# Altium schematic sheet Flyback Controller.SchDoc
size A; SheetNumber: 5; SheetTotal: 9
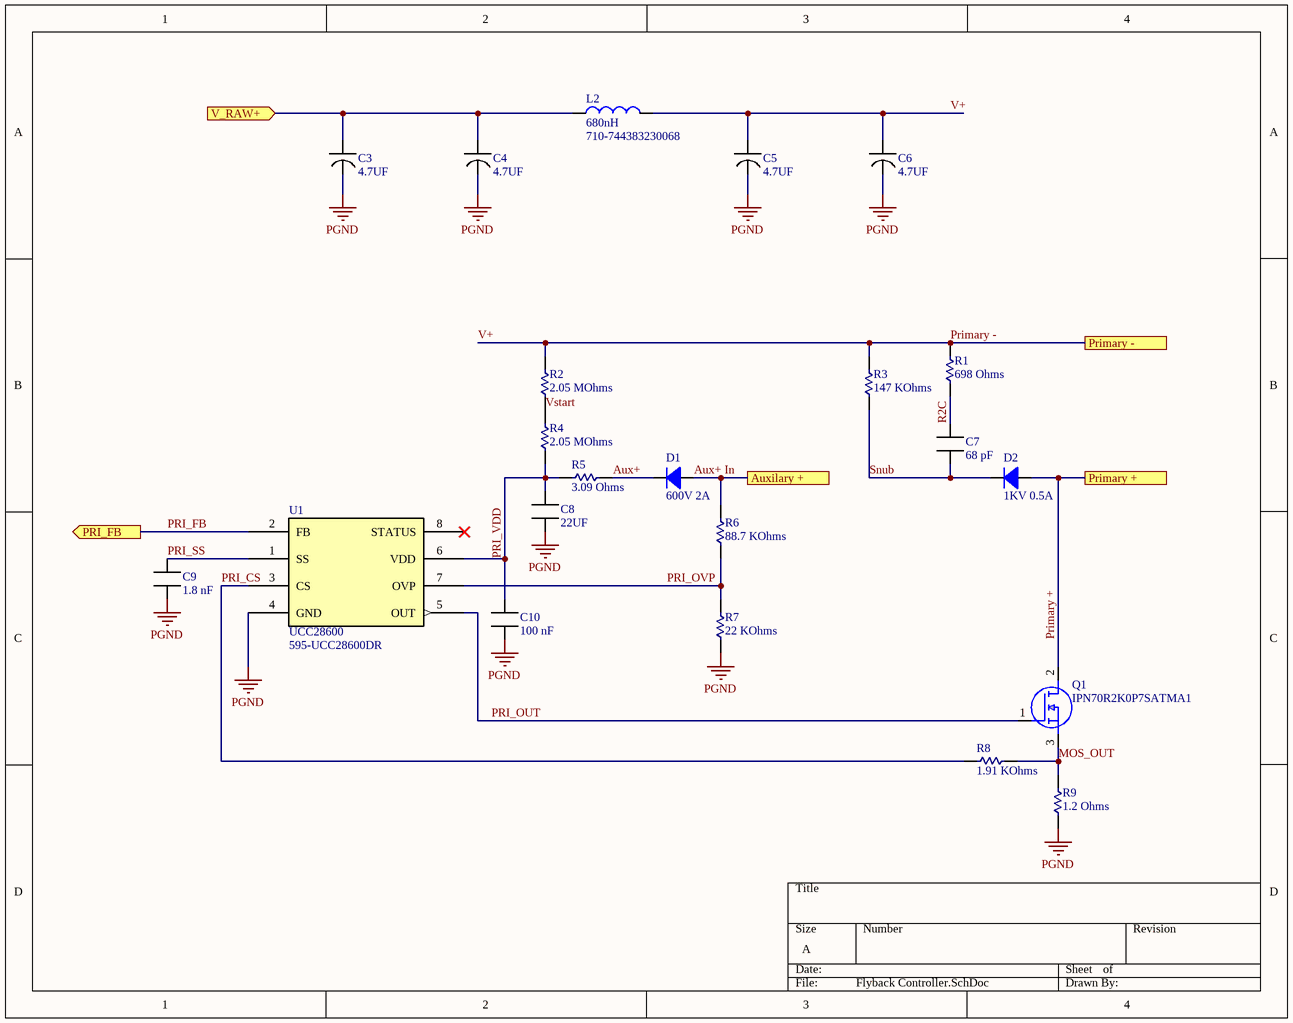
[diagram p0: Flyback Controller.SchDoc]

## Parts
C3  4.7UF  [Alum Radial Cap 5mm]
C4  4.7UF  [Alum Radial Cap 5mm]
C5  4.7UF  [Alum Radial Cap 5mm]
C6  4.7UF  [Alum Radial Cap 5mm]
C7  68 pF  [Cap 1206]
C8  22UF  [Res 0805]
C9  1.8 nF  [Cap 0603]
C10  100 nF  [Cap 1206]
D1  600V 2A  [FLAT_SMT]
D2  1KV 0.5A  [FLAT_SMT]
L2  680nH  Supplier Part Number 1: 710-744383230068  [IND 1008]
Q1  IPN70R2K0P7SATMA1  [SOT-223-3]
R1  698 Ohms  [Res 0805]
R2  2.05 MOhms  [RES 1206]
R3  147 KOhms  [Res 0805]
R4  2.05 MOhms  [RES 1206]
R5  3.09 Ohms  [Res 0805]
R6  88.7 KOhms  [Res 0805]
R7  22 KOhms  [Res 0805]
R8  1.91 KOhms  [Res 0805]
R9  1.2 Ohms  [RES 1206]
U1  UCC28600  Supplier Part Number 1: 595-UCC28600DR  [UCC28600]

## Ports
Auxilary +, PRI_FB (out), Primary +, Primary -, V_RAW+ (in)

## Nets
PGND: C3.2 C4.2 C5.2 C6.2 C8.1 C9.1 C10.1 R7.1(A) R9.1(A) U1.4(GND)
Aux+: D1.2 R5.2(B)
Aux+ In: D1.1 R6.2(B) ; port Auxilary +
MOS_OUT: Q1.3(S) R8.2(B) R9.2(B)
PRI_CS: R8.1(A) U1.3(CS)
PRI_FB: U1.2(FB) ; port PRI_FB
PRI_OUT: Q1.1(G) U1.5(OUT)
PRI_OVP: R6.1(A) R7.2(B) U1.7(OVP)
PRI_SS: C9.2 U1.1(SS)
PRI_VDD: C8.2 C10.2 R4.1(A) R5.1(A) U1.6(VDD)
Primary +: D2.1 Q1.2(D) ; port Primary +
Primary -: C5.1 C6.1 L2.2 R1.2(B) R2.2(B) R3.2(B) ; port Primary -  [also labelled V+]
R2C: C7.2 R1.1(A)
Snub: C7.1 D2.2 R3.1(A)
V_RAW+: C3.1 C4.1 L2.1 ; port V_RAW+
Vstart: R2.1(A) R4.2(B)

Not connected (* = marked no-connect by the designer): U1 8(STATUS)*

## Library data of the parts
C3-C6 = ESE475M400AH9AA: Aluminum Electrolytic Capacitors - Radial Leaded 400V 4.7uF 20% 1000Hrs; Supplier 1: Mouser; Supplier Part Number 1: 80-ESE475M400AH9AA
C7 = CC1206JKNPOCBN680: Multilayer Ceramic Capacitors MLCC - SMD/SMT 1k V 68 pF C0G 1206 5%; Supplier 1: Mouser; Supplier Part Number 1: 603-CC126JKNPOCBN680
C8 = CL21A226MAYNNNE: Multilayer Ceramic Capacitors MLCC - SMD/SMT 22uF+/-20% 25V X5R 2 0805; Supplier 1: Mouser; Supplier Part Number 1: 187-CL21A226MAYNNNE
C9 = VJ0603Y182KXACW1BC: Multilayer Ceramic Capacitors MLCC - SMD/SMT 0603 1800pF 50volts X7R 10%; Supplier 1: Mouser; Supplier Part Number 1: 77-VJ0603Y182KXACBC
C10 = CGA5L4X7T2W104M160AA: Multilayer Ceramic Capacitors MLCC - SMD/SMT CGA 1206 450V 0.1uF X7T 20% AEC-Q200; Supplier 1: Mouser; Supplier Part Number 1: 810-CGA5L4X7T2W104MA
D1 = CMF01(TE12L,Q,M): Diodes - General Purpose, Power, Switching 600V 2A M-FLAT; Supplier 1: Mouser; Supplier Part Number 1: 757-CMF01TE12LQM
D2 = CMF05(TE12L,Q,M): Rectifiers Super Fast Diode 1000V 0.5A 100ns; Supplier 1: Mouser; Supplier Part Number 1: 757-CMF05TE12LQM
L2 = 744383230068: Power Inductors - Leaded WE-MAPI 680nH 3.1A DCR=60mOhms AECQ200; Supplier 1: Mouser
Q1 = IPN70R2K0P7SATMA1: MOSFET CONSUMER 700V 3A 1.64Ohms; Supplier 1: Mouser; Supplier Part Number 1: 726-IPN70R2K0P7SATM1
R1 = RC0805FR-07698RL: Thick Film Resistors - SMD 698 Ohms 125 mW 0805 1%; Supplier 1: Mouser; Supplier Part Number 1: 603-RC0805FR-07698RL
R2 R4 = RC1206FR-072M05L: Thick Film Resistors - SMD 2.05 MOhms 250 mW 1206 1%; Supplier 1: Mouser; Supplier Part Number 1: 603-RC1206FR-072M05L
R3 = ERJ-P06F1473V: Thick Film Resistors - SMD 0805 147Kohms 0.5W 1% AEC-Q200; Supplier 1: Mouser; Supplier Part Number 1: 667-ERJ-P06F1473V
R5 = RC0805FR-073R09L: Thick Film Resistors - SMD 3.09Ohms 1/8W 0805 1%; Supplier 1: Mouser; Supplier Part Number 1: 603-RC0805FR-073R09L
R6 = ERA-6AEB8872V: Thin Film Resistors - SMD 0805 88.7Kohm 0.1% 25ppm; Supplier 1: Mouser; Supplier Part Number 1: 667-ERA-6AEB8872V
R7 = RT0805BRD0722KL: Thin Film Resistors - SMD 1/8W 22K ohm .1% 25ppm; Supplier 1: Mouser; Supplier Part Number 1: 603-RT0805BRD0722KL
R8 = CR0805-FX-1911ELF: Thick Film Resistors - SMD 1.91K 1%; Supplier 1: Mouser; Supplier Part Number 1: 652-CR0805FX-1911ELF
R9 = AC1206FR-071R2L: Thick Film Resistors - SMD 1.2Ohms 1/4W 1206 1% AEC-Q200 Standard Power Version; Supplier 1: Mouser; Supplier Part Number 1: 603-AC1206FR-071R2L
U1 = UCC28600DR: AC/DC Converters Quasi Res Flyback Green Mode Cntrlr; Supplier 1: Mouser